# EAGLE design main (EAGLE 6.5.0)
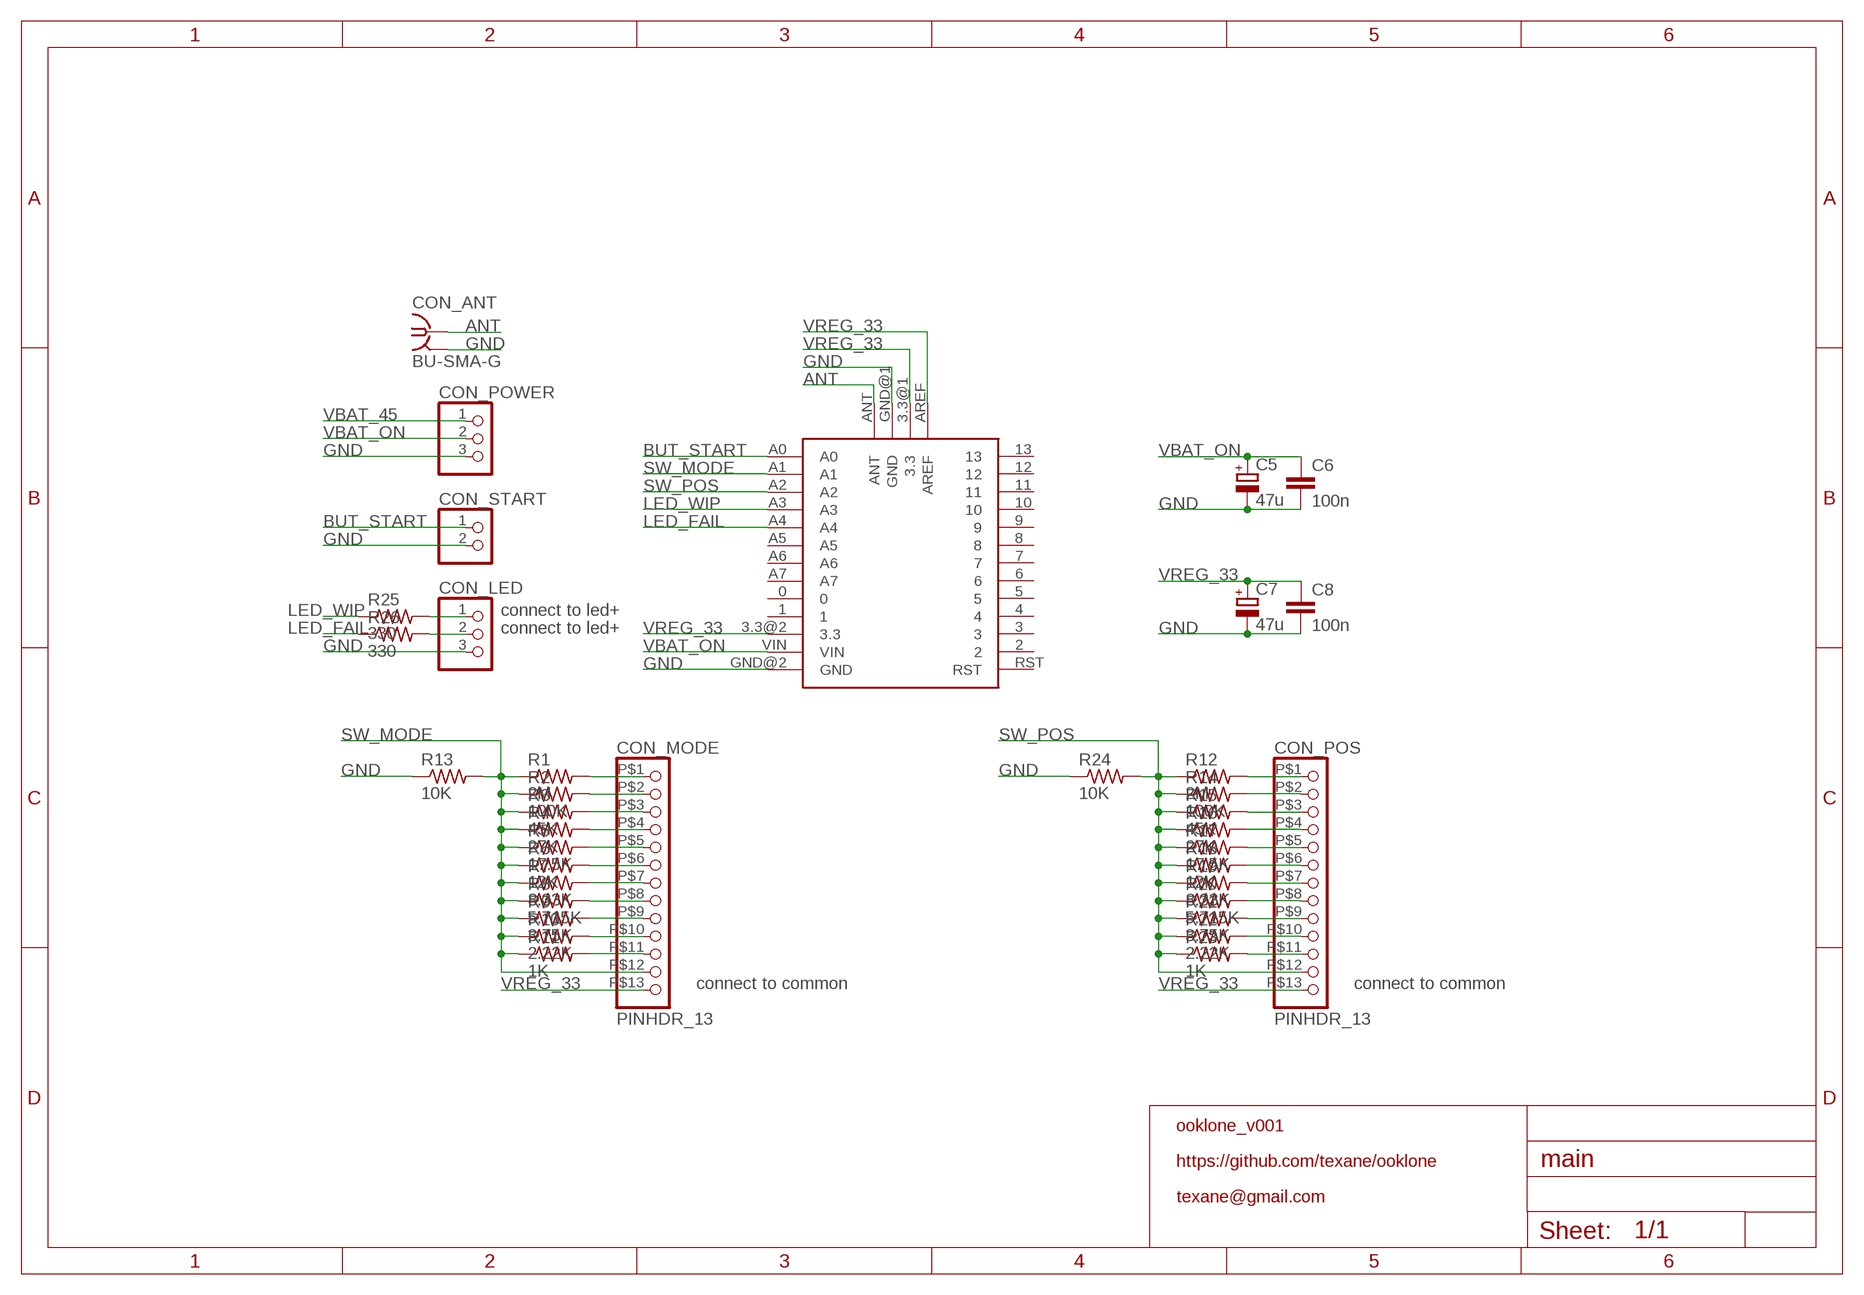
[diagram p0: schematic, sheet 1]

## Parts
C5  47u  CPOL-EUD  [PANASONIC_D]
C6  100n  C-EUC1206K  [C1206K]
C7  47u  CPOL-EUD  [PANASONIC_D]
C8  100n  C-EUC1206K  [C1206K]
CON_ANT  BU-SMA-G  [BU-SMA-G]
CON_LED  PINHD-1X3  [1X03]
CON_MODE  PINHDR_13  [PINHDR_13]
CON_POS  PINHDR_13  [PINHDR_13]
CON_POWER  PINHD-1X3  [1X03]
CON_START  PINHD-1X2  [1X02]
R1  2M  R-US_R1206  [R1206]
R2  100K  R-US_R1206  [R1206]
R3  45K  R-US_R1206  [R1206]
R4  27K  R-US_R1206  [R1206]
R5  17.5K  R-US_R1206  [R1206]
R6  12K  R-US_R1206  [R1206]
R7  8.33K  R-US_R1206  [R1206]
R8  5.715K  R-US_R1206  [R1206]
R9  3.75K  R-US_R1206  [R1206]
R10  2.22K  R-US_R1206  [R1206]
R11  1K  R-US_R1206  [R1206]
R12  2M  R-US_R1206  [R1206]
R13  10K  R-US_R1206  [R1206]
R14  100K  R-US_R1206  [R1206]
R15  45K  R-US_R1206  [R1206]
R16  27K  R-US_R1206  [R1206]
R17  17.5K  R-US_R1206  [R1206]
R18  12K  R-US_R1206  [R1206]
R19  8.33K  R-US_R1206  [R1206]
R20  5.715K  R-US_R1206  [R1206]
R21  3.75K  R-US_R1206  [R1206]
R22  2.22K  R-US_R1206  [R1206]
R23  1K  R-US_R1206  [R1206]
R24  10K  R-US_R1206  [R1206]
R25  330  R-US_R1206  [R1206]
R26  330  R-US_R1206  [R1206]
U$1  MOTEINO_USB_R4  [MOTEINO_USB_R4]

## Nets
ANT: CON_ANT.1 U$1.ANT
BUT_START: CON_START.1 U$1.A0
GND: C5.- C6.2 C7.- C8.2 CON_ANT.2 CON_ANT.3 CON_ANT.4 CON_ANT.5 CON_LED.3 CON_POWER.3 CON_START.2 R13.1 R24.1 U$1.GND@1(GND) U$1.GND@2(GND)
LED_FAIL: R26.1 U$1.A4
LED_WIP: R25.1 U$1.A3
N$1: CON_MODE.P$1 R1.2
N$2: CON_MODE.P$2 R2.2
N$3: CON_MODE.P$3 R3.2
N$5: CON_MODE.P$4 R4.2
N$6: CON_MODE.P$5 R5.2
N$7: CON_MODE.P$6 R6.2
N$8: CON_MODE.P$7 R7.2
N$9: CON_MODE.P$8 R8.2
N$10: CON_MODE.P$9 R9.2
N$11: CON_MODE.P$10 R10.2
N$12: CON_MODE.P$11 R11.2
N$13: CON_POS.P$1 R12.2
N$14: CON_POS.P$2 R14.2
N$15: CON_POS.P$3 R15.2
N$16: CON_POS.P$4 R16.2
N$17: CON_POS.P$5 R17.2
N$18: CON_POS.P$6 R18.2
N$19: CON_POS.P$7 R19.2
N$20: CON_POS.P$8 R20.2
N$21: CON_POS.P$9 R21.2
N$22: CON_POS.P$10 R22.2
N$23: CON_POS.P$11 R23.2
N$24: CON_LED.1 R25.2
N$25: CON_LED.2 R26.2
SW_MODE: CON_MODE.P$12 R1.1 R2.1 R3.1 R4.1 R5.1 R6.1 R7.1 R8.1 R9.1 R10.1 R11.1 R13.2 U$1.A1
SW_POS: CON_POS.P$12 R12.1 R14.1 R15.1 R16.1 R17.1 R18.1 R19.1 R20.1 R21.1 R22.1 R23.1 R24.2 U$1.A2
VBAT_45: CON_POWER.1
VBAT_ON: C5.+ C6.1 CON_POWER.2 U$1.VIN
VREG_33: C7.+ C8.1 CON_MODE.P$13 CON_POS.P$13 U$1.3.3@1(3.3) U$1.3.3@2(3.3) U$1.AREF
Unconnected: U$1.0 U$1.1 U$1.2 U$1.3 U$1.4 U$1.5 U$1.6 U$1.7 U$1.8 U$1.9 U$1.10 U$1.11 U$1.12 U$1.13 U$1.A5 U$1.A6 U$1.A7 U$1.RST

## Notes on the sheet
- connect to led+
- connect to led+
- connect to common | connect to common
- ooklone_v001
- https://github.com/texane/ooklone
- texane@gmail.com

## Library data of the parts
C5 C7 = rcl:CPOL-EU: POLARIZED CAPACITOR, European symbol
C6 C8 = rcl:C-EU: CAPACITOR, European symbol
CON_ANT = con-coax:BU-SMA-G: FEMALE SMA CONNECTOR Radiall distributor RS 193-9117; OC_FARNELL: unknown; OC_NEWARK: unknown
CON_LED CON_POWER = pinhead:PINHD-1X3: PIN HEADER
CON_MODE CON_POS = pinhdr_13:PINHDR_13
CON_START = pinhead:PINHD-1X2: PIN HEADER
R1-R26 = resistor:R-US_: RESISTOR, American symbol
U$1 = moteino_usb_r4:MOTEINO_USB_R4

## Board
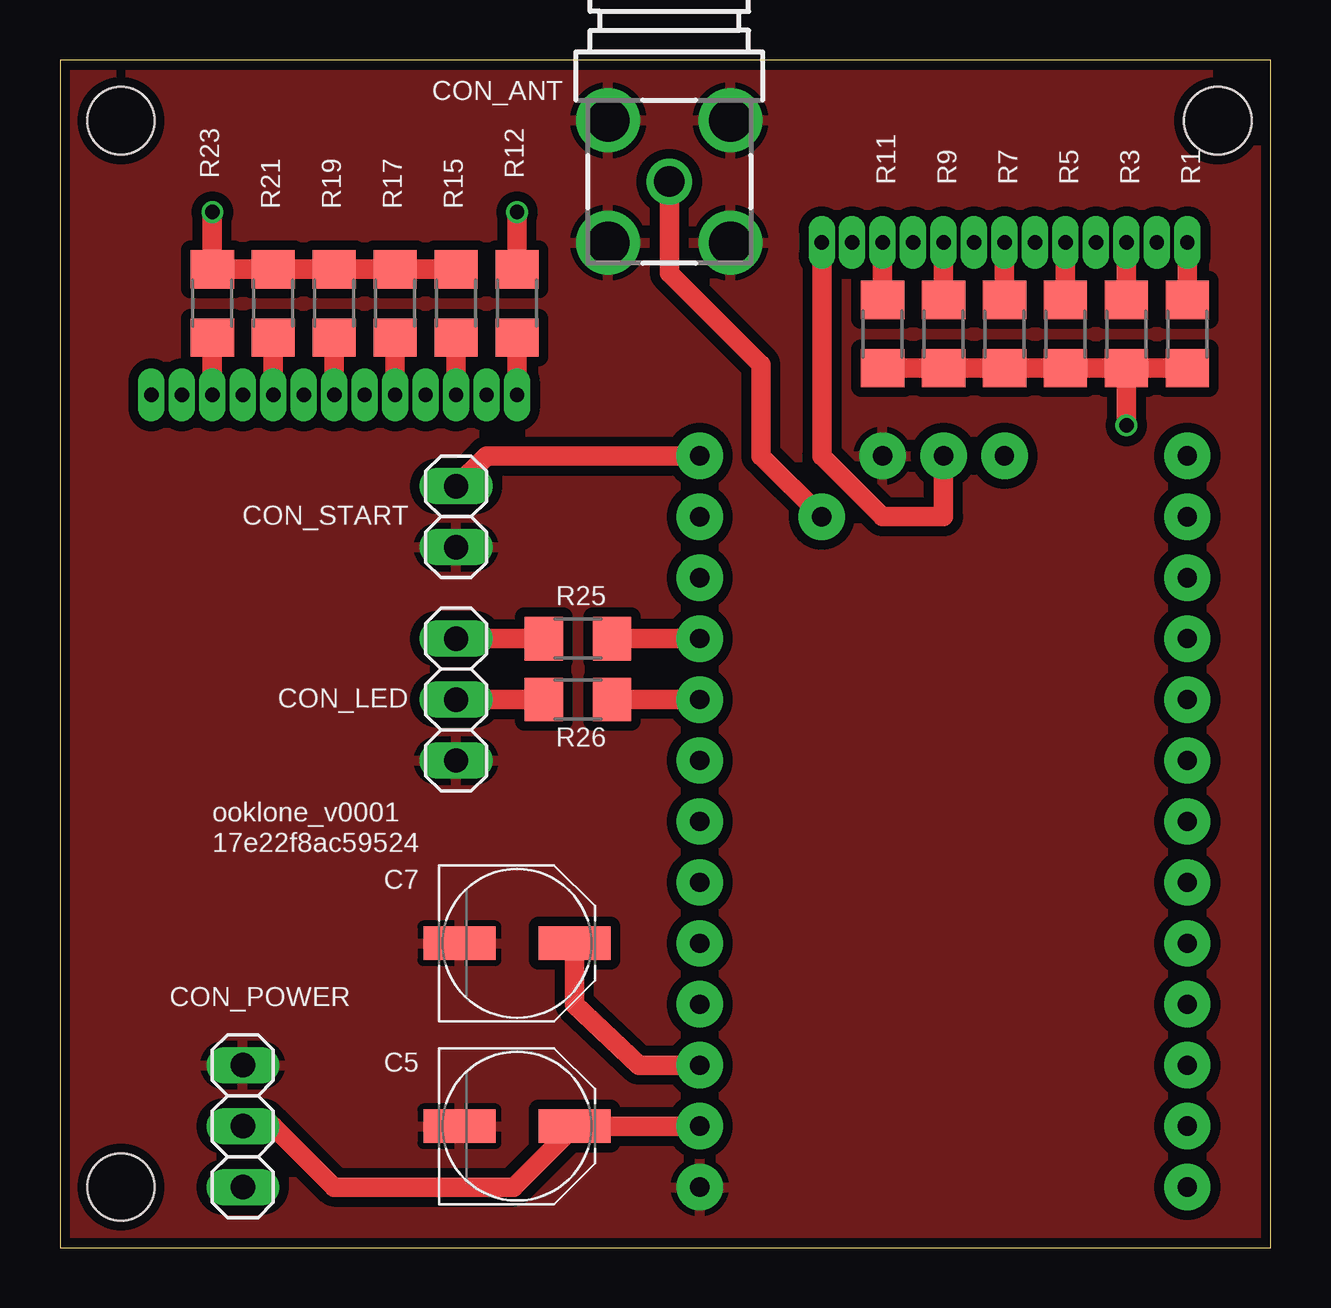
[diagram p1: board, top side]
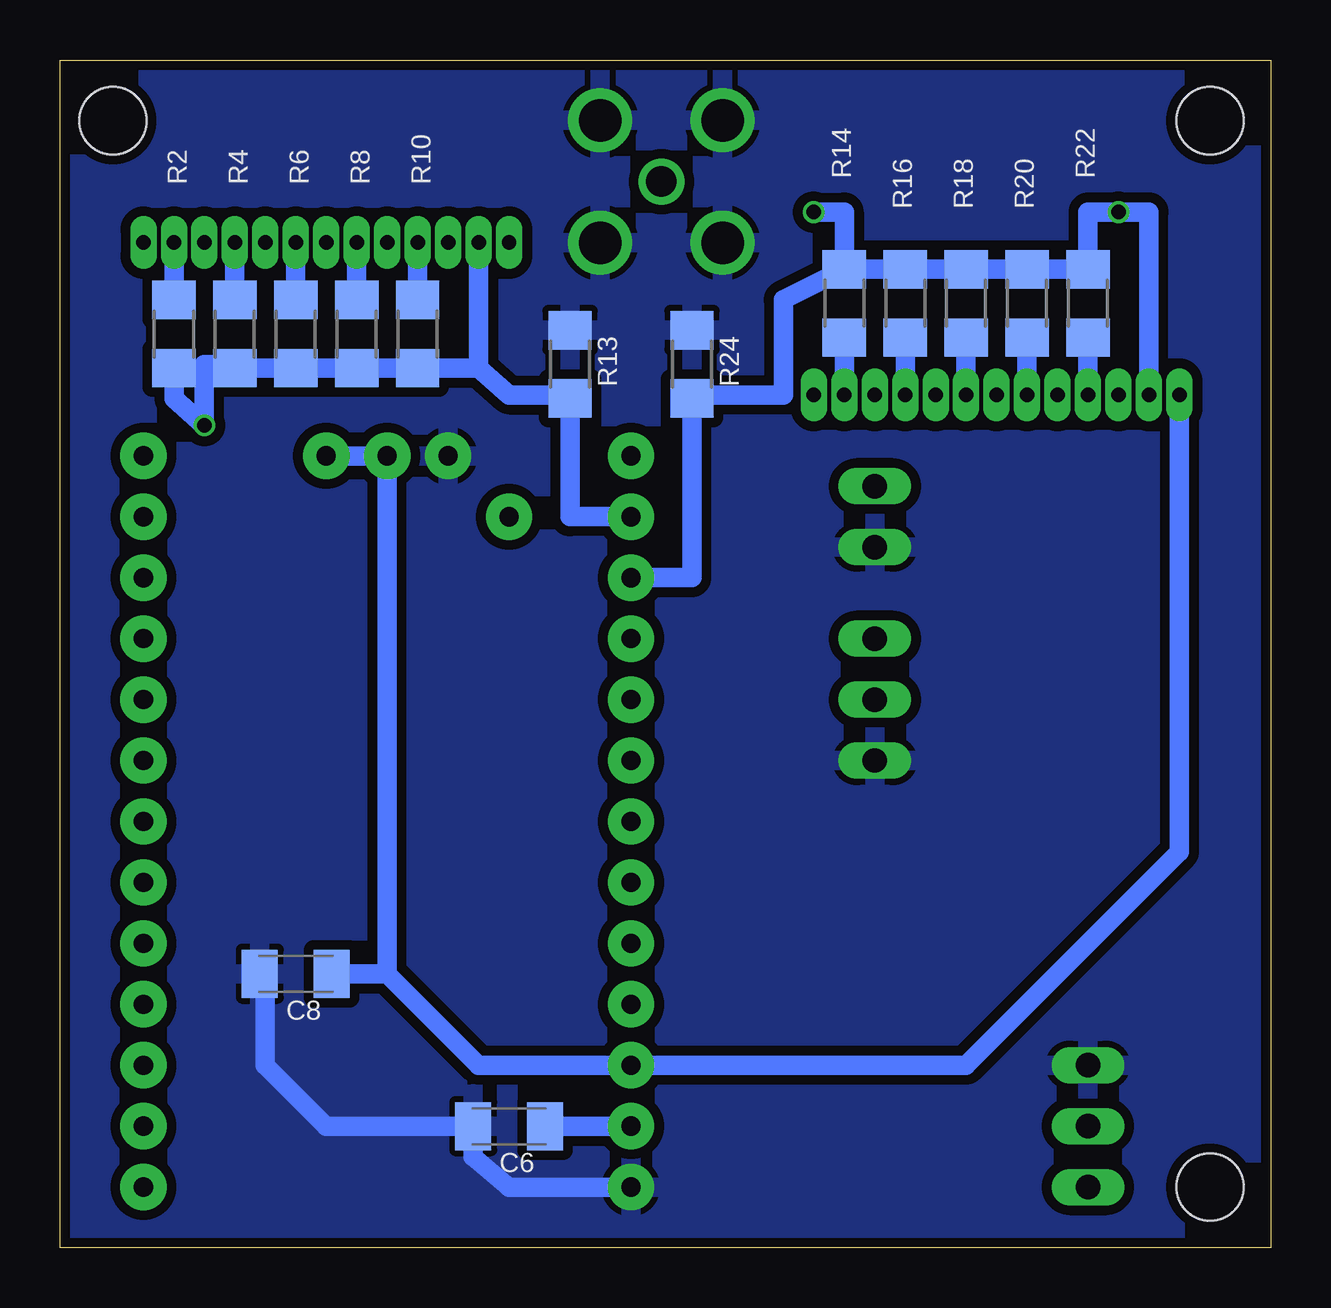
[diagram p2: board, bottom side, seen from below]

Size 50.47 x 49.52 mm. Coordinates in mm from the lower left corner, seen from the top.
Outline: 0,0 50.47,0 50.47,49.52 0,49.52 0,0
Copper layers (1*16): Top 0.035mm / dielectric 1.5mm / Bottom 0.035mm
Design rules "SeeedStudio_DRU_no_angle_2layer": minimum track width 6mil, minimum drill 12mil, track to track 6mil, track to pad 6mil, pad to pad 6mil, via to via 6mil, smd to smd 0mil, copper to edge 10mil, drill to drill 10mil, minimum pad ring 10mil, minimum via ring 6mil, stop-mask expansion 2mil, vias tented up to drill 25mil, thermal gap 10mil
Holes 2.8 mm at 48.26,46.99 2.54,46.99 2.54,2.54

### Footprints (pad centres in the part's own frame; a part is rotated, then mirrored left to right if it is on the bottom)
PANASONIC_D = smd 3 x 1.4: + 2.4,0; - -2.4,0
C1206K = smd 1.5 x 2: 1 -1.5,0; 2 1.5,0
BU-SMA-G = drill 1.27: 1 0,0 | drill 1.778: 2 -2.55,2.55; 3 2.55,2.55; 4 2.55,-2.55; 5 -2.55,-2.55
1X03 = drill 1.016 long: 1 -2.54,0; 2 0,0; 3 2.54,0
PINHDR_13 = drill 0.6 pad 1.016 long: P$1 0,7.62; P$2 0,6.35; P$3 0,5.08; P$4 0,3.81; P$5 0,2.54; P$6 0,1.27; P$7 0,0; P$8 0,-1.27; P$9 0,-2.54; P$10 0,-3.81; P$11 0,-5.08; P$12 0,-6.35; P$13 0,-7.62
1X02 = drill 1.016 long: 1 -1.27,0; 2 1.27,0
R1206 = smd 1.6 x 1.803: 1 -1.422,0; 2 1.422,0
MOTEINO_USB_R4 = drill 0.8 pad 1.93: 0 0,10.16; 1 0,7.62; 2 20.32,2.54; 3 20.32,5.08; 3.3@1 10.16,30.48; 3.3@2 0,5.08; 4 20.32,7.62; 5 20.32,10.16; 6 20.32,12.7; 7 20.32,15.24; 8 20.32,17.78; 9 20.32,20.32; 10 20.32,22.86; 11 20.32,25.4; 12 20.32,27.94; 13 20.32,30.48; A0 0,30.48; A1 0,27.94; A2 0,25.4; A3 0,22.86; A4 0,20.32; A5 0,17.78; A6 0,15.24; A7 0,12.7; ANT 5.08,27.94; AREF 12.7,30.48; GND@1 7.62,30.48; GND@2 0,0; RST 20.32,0; VIN 0,2.54

### Placement (x,y rotation side)
C5  19.05,5.08 0 top
C6  31.75,5.08 180 bottom
C7  19.05,12.7 0 top
C8  40.64,11.43 180 bottom
CON_ANT  25.4,44.45 90 top
CON_LED  16.51,22.86 270 top
CON_MODE  39.37,41.91 270 top
CON_POS  11.43,35.56 270 top
CON_POWER  7.62,5.08 90 top
CON_START  16.51,30.48 270 top
R1  46.99,38.1 90 top
R2  45.72,38.1 90 bottom
R3  44.45,38.1 90 top
R4  43.18,38.1 90 bottom
R5  41.91,38.1 90 top
R6  40.64,38.1 90 bottom
R7  39.37,38.1 90 top
R8  38.1,38.1 90 bottom
R9  36.83,38.1 90 top
R10  35.56,38.1 90 bottom
R11  34.29,38.1 90 top
R12  19.05,39.37 270 top
R13  29.21,36.83 270 bottom
R14  17.78,39.37 270 bottom
R15  16.51,39.37 270 top
R16  15.24,39.37 270 bottom
R17  13.97,39.37 270 top
R18  12.7,39.37 270 bottom
R19  11.43,39.37 270 top
R20  10.16,39.37 270 bottom
R21  8.89,39.37 270 top
R22  7.62,39.37 270 bottom
R23  6.35,39.37 270 top
R24  24.13,36.83 270 bottom
R25  21.59,25.4 180 top
R26  21.59,22.86 180 top
U$1  26.67,2.54 0 top

### Tracks (layer width: path | path; a pad name or v marks a point on that pad's centre or on a via)
ANT
  Top 0.813: U$1.ANT 29.21,33.02 29.21,36.83 25.4,40.64 CON_ANT.1
BUT_START
  Top 0.813: CON_START.1 17.78,33.02 U$1.A0
GND
  Bottom 0.813: U$1.GND@2 31.75,2.54 33.25,3.81 C6.2 39.37,5.08 41.91,7.62 41.91,11.43 C8.2
  pour Top (isolate 0.406): 0,49.53 50.8,49.53 50.8,0 0,0
  pour Bottom (isolate 0.406): 0,49.53 50.8,49.53 50.8,0 0,0
LED_FAIL
  Top 0.813: U$1.A4 R26.1
LED_WIP
  Top 0.813: U$1.A3 R25.1
N$1
  Top 0.813: CON_MODE.P$1 R1.2
N$2
  Bottom 0.813: R2.2 CON_MODE.P$2
N$3
  Top 0.813: CON_MODE.P$3 R3.2
N$5
  Bottom 0.813: R4.2 CON_MODE.P$4
N$6
  Top 0.813: CON_MODE.P$5 R5.2
N$7
  Bottom 0.813: R6.2 CON_MODE.P$6
N$8
  Top 0.813: CON_MODE.P$7 R7.2
N$9
  Bottom 0.813: R8.2 CON_MODE.P$8
N$10
  Top 0.813: CON_MODE.P$9 R9.2
N$11
  Bottom 0.813: R10.2 CON_MODE.P$10
N$12
  Top 0.813: CON_MODE.P$11 R11.2
N$13
  Top 0.813: CON_POS.P$1 R12.2
N$14
  Bottom 0.813: R14.2 CON_POS.P$2
N$15
  Top 0.813: CON_POS.P$3 R15.2
N$16
  Bottom 0.813: R16.2 CON_POS.P$4
N$17
  Top 0.813: CON_POS.P$5 R17.2
N$18
  Bottom 0.813: R18.2 CON_POS.P$6
N$19
  Top 0.813: CON_POS.P$7 R19.2
N$20
  Bottom 0.813: R20.2 CON_POS.P$8
N$21
  Top 0.813: CON_POS.P$9 R21.2
N$22
  Bottom 0.813: R22.2 CON_POS.P$10
N$23
  Top 0.813: CON_POS.P$11 R23.2
N$24
  Top 0.813: CON_LED.1 R25.2
N$25
  Top 0.813: CON_LED.2 R26.2
SW_MODE  (via drill 0.6)
  Top 0.813: R1.1 R3.1 | R11.1 R9.1 R7.1 R5.1 R3.1 | R3.1 v44.45,34.29
  Bottom 0.813: U$1.A1 29.21,30.48 R13.2 29.21,35.56 31.75,35.56 33.02,36.68 | CON_MODE.P$12 33.02,36.68 | 33.02,36.68 R10.1 R8.1 R6.1 R4.1 43.18,36.83 44.45,36.83 v44.45,34.29 45.72,35.41 R2.1
SW_POS  (via drill 0.6)
  Top 0.813: R15.1 R17.1 R19.1 R21.1 R23.1 v6.35,43.18 | R12.1 v19.05,43.18
  Bottom 0.813: R14.1 R16.1 R18.1 R20.1 R22.1 7.62,43.18 v6.35,43.18 5.08,43.18 CON_POS.P$12 | U$1.A2 24.13,27.94 R24.2 24.13,35.56 20.32,35.56 20.32,39.52 R14.1 | v19.05,43.18 17.78,43.18 R14.1
VBAT_ON
  Top 0.813: U$1.VIN C5.+ 18.91,2.54 11.43,2.54 8.89,5.08 CON_POWER.2
  Bottom 0.813: C6.1 U$1.VIN
VREG_33
  Top 0.813: CON_MODE.P$13 31.75,33.02 34.29,30.48 36.83,30.48 U$1.3.3@1 | U$1.3.3@2 24.13,7.62 21.45,10.16 C7.+
  Bottom 0.813: 36.83,11.43 33.02,7.62 U$1.3.3@2 12.7,7.62 3.81,16.51 CON_POS.P$13 | 36.83,11.43 U$1.3.3@1 U$1.AREF | C8.1 36.83,11.43

### Text on the board
tNames: ooklone_v0001 | 17e22f8ac59524